# Altium schematic sheet Project input.SchDoc
size A4; SheetNumber: 2; SheetTotal: 6
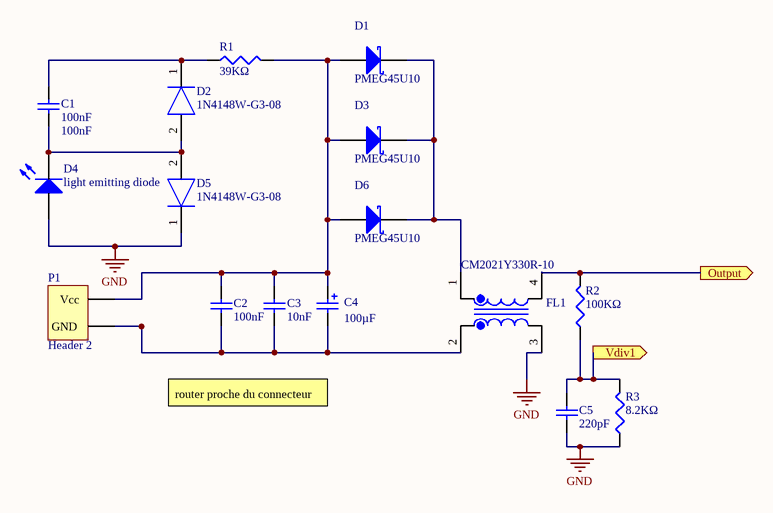
[diagram p0: Project input.SchDoc]

## Parts
C1  100nF  [CAPC3216X180N]
C2  100nF  [CAPC3216X180N]
C3  10nF  [CAPC3216X180N]
C4  100µF  [EEE0JA471UAP]
C5  220pF  [CAPC3216X180N]
D1  PMEG45U10  [TO-220AC]
D2  1N4148W-G3-08  [SOD3716X135N]
D3  PMEG45U10  [TO-220AC]
D4  light emitting diode  [LEDM3216X78N]
D5  1N4148W-G3-08  [SOD3716X135N]
D6  PMEG45U10  [TO-220AC]
FL1  CM2021Y330R-10  [CM2021Y330R10]
P1  Header 2  [HDR1X2]
R1  39KΩ  [RESC3216X75N]
R2  100KΩ  [RESC3216X75N]
R3  8.2KΩ  [RESC3216X75N]

## Ports
Output (out), Vdiv1 (out)

## Nets
GND: C5.1 D4.69 D5.1(K) FL1.3 R3.1
Output: FL1.4 R2.2 ; port Output
Vdiv1: C5.2 R2.1 R3.2 ; port Vdiv1
NetC1_1: C1.1 D2.1(K) R1.1
NetC1_2: C1.2 D2.2(A) D4.69 D5.2(A)
NetC2_1: C2.1 C3.2 C4.1 D1.3(A) D3.3(A) D6.3(A) P1.?1(Vcc) R1.2
NetC2_2: C2.2 C3.1 C4.2 FL1.2 P1.?2(GND)
NetD1_1: D1.1(K) D3.1(K) D6.1(K) FL1.1

## Notes on the sheet
- router proche du connecteur

## Library data of the parts
C1 C2 = 100nF: Capacitor; Published: 8-Jun-2000; LatestRevisionDate: 17-Jul-2002; LatestRevisionNote: Re-released for DXP Platform.; PackageReference: RAD-0.3; Publisher: Altium Limited; PackageDescription: Radial Cap, Thru-Hole; 2 Leads; 0.3 in Pin Spacing; Value: 100nF
C3 = 10nF: Capacitor; Published: 8-Jun-2000; LatestRevisionDate: 17-Jul-2002; LatestRevisionNote: Re-released for DXP Platform.; PackageReference: RAD-0.3; Publisher: Altium Limited; PackageDescription: Radial Cap, Thru-Hole; 2 Leads; 0.3 in Pin Spacing; Value: 10nF
C4 = 100µF: Capacitor Polarised; Manufacturer_Name: Panasonic; Manufacturer_Part_Number: EEV-FK1K101V; Datasheet Link: http://industrial.panasonic.com/cdbs/www-data/pdf/RDE0000/ABA0000C1181.pdf; Height: 14.3mm; Mouser Part Number: 667-EEV-FK1K101V; Mouser Price/Stock: https://www.mouser.co.uk/ProductDetail/Panasonic/EEV-FK1K101V?qs=MtOUKumLmnbTFvRMlB7%2FdA%3D%3D
C5 = 220pF: Capacitor; Published: 8-Jun-2000; LatestRevisionDate: 17-Jul-2002; LatestRevisionNote: Re-released for DXP Platform.; PackageReference: RAD-0.3; Publisher: Altium Limited; PackageDescription: Radial Cap, Thru-Hole; 2 Leads; 0.3 in Pin Spacing; Value: 220pF
D1 D3 D6 = Diode 10TQ035: Schottky Rectifier; Note: Terminal 2 is the TAB and is electrically connected to the cathode; Published: 8-Jun-2000; LatestRevisionDate: 17-Jul-2002; LatestRevisionNote: Re-released for DXP Platform.; DatasheetVersion: PD-2.057B; PackageVersion: Feb-1998; PackageReference: TO-220AC; Publisher: Altium Limited; PackageDescription: TO, Thru-Hole, Vertical, Heatsink Mounted; 3 In-Line Leads (1 Absent); Pitch 2.54 mm; ComponentLink1Description: Manufacturer Link; ComponentLink1URL: http://www.irf.com/; ComponentLink2Description: Datasheet; ComponentLink2URL: http://www.irf.com/product-info/datasheets/data/10tq.pdf
D2 D5 = 1N4148W-G3-08: Diode; Manufacturer_Name: Vishay; Datasheet Link: https://componentsearchengine.com/Datasheets/1/1N4148W-G3-08.pdf; Height: 1.35mm; Manufacturer_Part_Number: 1N4148W-G3-08; Mouser Part Number: 78-1N4148W-G3-08; Mouser Price/Stock: https://www.mouser.co.uk/ProductDetail/Vishay-Semiconductors/1N4148W-G3-08?qs=uS%252BVSIFnvp46StDBB15x4Q%3D%3D; Arrow Part Number: 1N4148W-G3-08; Arrow Price/Stock: https://www.arrow.com/en/products/1n4148w-g3-08/vishay
FL1 = CM2021Y330R-10: Filter; Manufacturer_Name: Laird-Signal Integrity Products; Datasheet Link: http://assets.lairdtech.com/home/brandworld/files/CM2021Y330R-10.pdf; Height: 3.8mm; Manufacturer_Part_Number: CM2021Y330R-10
P1 = Header 2: Header, 2-Pin; LatestRevisionDate: 17-Jul-2002; LatestRevisionNote: Re-released for DXP Platform.; Publisher: Altium Limited
R1 = 39KΩ: Resistor; Published: 8-Jun-2000; LatestRevisionDate: 29-May-2009; LatestRevisionNote: IPC-7351 Footprint Added.; PackageReference: J1-0603; Publisher: Altium Limited; PackageDescription: Chip Resistor; supplier: farnell
R2 = 100KΩ: Resistor; Published: 8-Jun-2000; LatestRevisionDate: 29-May-2009; LatestRevisionNote: IPC-7351 Footprint Added.; PackageReference: J1-0603; Publisher: Altium Limited; PackageDescription: Chip Resistor
R3 = 8.2KΩ: Resistor; Published: 8-Jun-2000; LatestRevisionDate: 29-May-2009; LatestRevisionNote: IPC-7351 Footprint Added.; PackageReference: J1-0603; Publisher: Altium Limited; PackageDescription: Chip Resistor